# Altium schematic sheet battery.SchDoc
size B
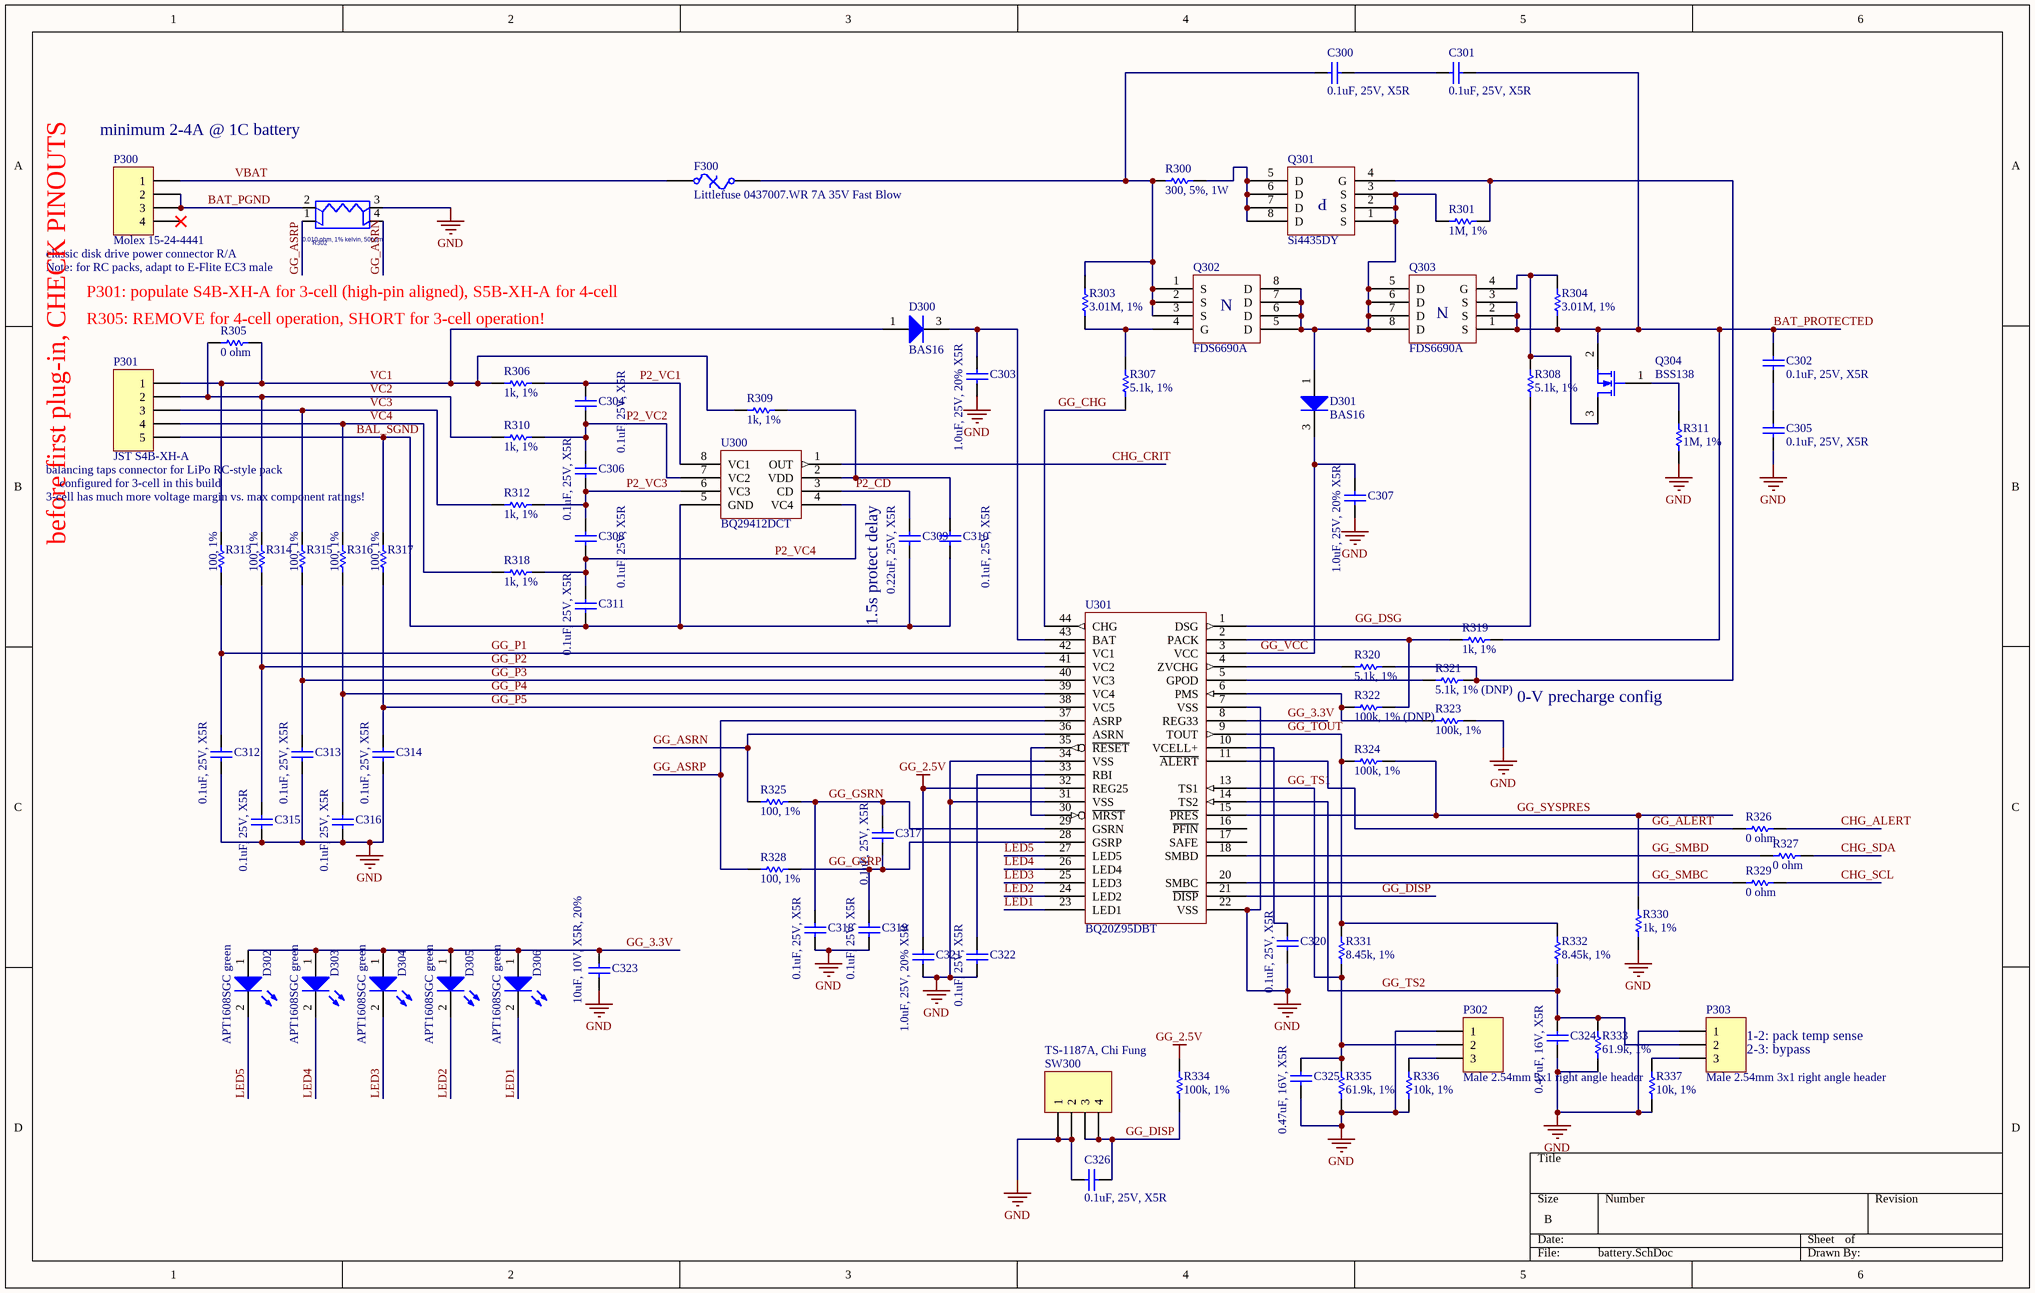
[diagram p0: battery.SchDoc]

## Parts
C300  0.1uF, 25V, X5R  [CAPC1005N]
C301  0.1uF, 25V, X5R  [CAPC1005N]
C302  0.1uF, 25V, X5R  [CAPC1005N]
C303  1.0uF, 25V, 20% X5R  [CAPC1608N]
C304  0.1uF, 25V, X5R  [CAPC1005N]
C305  0.1uF, 25V, X5R  [CAPC1005N]
C306  0.1uF, 25V, X5R  [CAPC1005N]
C307  1.0uF, 25V, 20% X5R  [CAPC1608N]
C308  0.1uF, 25V, X5R  [CAPC1005N]
C309  0.22uF, 25V, X5R  [CAPC1005N]
C310  0.1uF, 25V, X5R  [CAPC1005N]
C311  0.1uF, 25V, X5R  [CAPC1005N]
C312  0.1uF, 25V, X5R  [CAPC1005N]
C313  0.1uF, 25V, X5R  [CAPC1005N]
C314  0.1uF, 25V, X5R  [CAPC1005N]
C315  0.1uF, 25V, X5R  [CAPC1005N]
C316  0.1uF, 25V, X5R  [CAPC1005N]
C317  0.1uF, 25V, X5R  [CAPC1005N]
C318  0.1uF, 25V, X5R  [CAPC1005N]
C319  0.1uF, 25V, X5R  [CAPC1005N]
C320  0.1uF, 25V, X5R  [CAPC1005N]
C321  1.0uF, 25V, 20% X5R  [CAPC1608N]
C322  0.1uF, 25V, X5R  [CAPC1005N]
C323  10uF, 10V, X5R, 20%  [CAPC1608N]
C324  0.47uF, 16V, X5R  [CAPC1005N]
C325  0.47uF, 16V, X5R  [CAPC1005N]
C326  0.1uF, 25V, X5R  [CAPC1005N]
D300  BAS16  [SOT23-3N]
D301  BAS16  [SOT23-3N]
D302  APT1608SGC green  [CD1608-0603]
D303  APT1608SGC green  [CD1608-0603]
D304  APT1608SGC green  [CD1608-0603]
D305  APT1608SGC green  [CD1608-0603]
D306  APT1608SGC green  [CD1608-0603]
F300  Littlefuse 0437007.WR 7A 35V Fast Blow  [RESC3216N]
P300  Molex 15-24-4441  [MOLEX_15-24-4441]
P301  JST S4B-XH-A  [JST_S5B-XH-A_OPT4]
P302  Male 2.54mm 3x1 right angle header  [HDR1X3H]
P303  Male 2.54mm 3x1 right angle header  [HDR1X3H]
Q301  Si4435DY  [SOIC127P600-8AN]
Q302  FDS6690A  [SOIC127P600-8AN]
Q303  FDS6690A  [SOIC127P600-8AN]
Q304  BSS138  [SOT23-3N]
R300  300, 5%, 1W  [RESC6432N]
R301  1M, 1%  [RESC1005N]
R302  0.010 ohm, 1% kelvin, 50ppm  [OHMITE_LVK_1206_KELVIN]
R303  3.01M, 1%  [RESC1005N]
R304  3.01M, 1%  [RESC1005N]
R305  0 ohm  [RESC1005N]
R306  1k, 1%  [RESC1005N]
R307  5.1k, 1%  [RESC1005N]
R308  5.1k, 1%  [RESC1005N]
R309  1k, 1%  [RESC1005N]
R310  1k, 1%  [RESC1005N]
R311  1M, 1%  [RESC1005N]
R312  1k, 1%  [RESC1005N]
R313  100, 1%  [RESC1005N]
R314  100, 1%  [RESC1005N]
R315  100, 1%  [RESC1005N]
R316  100, 1%  [RESC1005N]
R317  100, 1%  [RESC1005N]
R318  1k, 1%  [RESC1005N]
R319  1k, 1%  [RESC1005N]
R320  5.1k, 1%  [RESC1005N]
R321  5.1k, 1% (DNP)  [RESC1005N]
R322  100k, 1% (DNP)  [RESC1005N]
R323  100k, 1%  [RESC1005N]
R324  100k, 1%  [RESC1005N]
R325  100, 1%  [RESC1005N]
R326  0 ohm  [RESC1005N]
R327  0 ohm  [RESC1005N]
R328  100, 1%  [RESC1005N]
R329  0 ohm  [RESC1005N]
R330  1k, 1%  [RESC1005N]
R331  8.45k, 1%  [RESC1005N]
R332  8.45k, 1%  [RESC1005N]
R333  61.9k, 1%  [RESC1005N]
R334  100k, 1%  [RESC1005N]
R335  61.9k, 1%  [RESC1005N]
R336  10k, 1%  [RESC1005N]
R337  10k, 1%  [RESC1005N]
SW300  TS-1187A, Chi Fung  [SWITCH_TS-1187A]
U300  BQ29412DCT  [TSOP65P490-8AN]
U301  BQ20Z95DBT  [TSSOP50P640-44N]

## Nets
GG_2.5V: C321.1 R334.2 U301.32(REG25)
GND: C303.2 C305.1 C307.2 C312.2 C313.2 C314.2 C315.2 C316.2 C318.2 C319.2 C320.2 C321.2 C322.2 C323.2 C324.2 C325.2 C326.2 P302.1 P303.1 R302.3 R311.2 R323.2 R330.2 R333.1 R335.1 R336.1 R337.1 SW300.1 SW300.2 U301.7(VSS) U301.22(VSS) U301.31(VSS) U301.34(VSS)
BAL_SGND: C309.2 C310.2 C311.2 P301.5 R317.1 U300.5(GND)
BAT_PGND: P300.2 P300.3 R302.2
BAT_PROTECTED: C301.1 C302.2 Q303.1(S) Q303.2(S) Q303.3(S) Q304.2(S) R304.2 R319.1
CHG_ALERT: R326.2
CHG_CRIT: U300.1(OUT)
CHG_SCL: R329.2
CHG_SDA: R327.2
GG_3.3V: C323.1 D302.1(A) D303.1(A) D304.1(A) D305.1(A) D306.1(A) U301.8(REG33)
GG_ALERT: R326.1 U301.11(~{ALERT})
GG_ASRN: R302.4 R325.2 U301.36(ASRN)
GG_ASRP: R302.1 R328.2 U301.37(ASRP)
GG_CHG: R307.2 U301.44(CHG)
GG_DISP: C326.1 R334.1 SW300.3 SW300.4 U301.21(~{DISP})
GG_DSG: R308.2 U301.1(DSG)
GG_GSRN: C317.1 C318.1 R325.1 U301.29(GSRN)
GG_GSRP: C317.2 C319.1 R328.1 U301.28(GSRP)
GG_P1: C312.1 R313.2 U301.42(VC1)
GG_P2: C315.1 R314.2 U301.41(VC2)
GG_P3: C313.1 R315.2 U301.40(VC3)
GG_P4: C316.1 R316.2 U301.39(VC4)
GG_P5: C314.1 R317.2 U301.38(VC5)
GG_SMBC: R329.1 U301.20(SMBC)
GG_SMBD: R327.1 U301.18(SMBD)
GG_SYSPRES: R324.2 R330.1 U301.15(~{PRES})
GG_TOUT: R324.1 R331.2 R332.2 U301.9(TOUT)
GG_TS1: C325.1 P302.2 R331.1 R335.2 U301.13(TS1)
GG_TS2: C324.1 P303.2 R332.1 R333.2 U301.14(TS2)
GG_VCC: C307.1 D301.3(K) U301.3(VCC)
LED1: D306.2(K) U301.23(LED1)
LED2: D305.2(K) U301.24(LED2)
LED3: D304.2(K) U301.25(LED3)
LED4: D303.2(K) U301.26(LED4)
LED5: D302.2(K) U301.27(LED5)
P2_CD: C309.1 U300.3(CD)
P2_VC1: C304.1 R306.2 U300.8(VC1)
P2_VC2: C304.2 C306.1 R310.2 U300.7(VC2)
P2_VC3: C306.2 C308.1 R312.2 U300.6(VC3)
P2_VC4: C308.2 C311.1 R318.2 U300.4(VC4)
VBAT: F300.1 P300.1
VC1: D300.1(A) P301.1 R305.2 R306.1 R309.1 R313.1
VC2: P301.2 R305.1 R310.1 R314.1
VC3: P301.3 R312.1 R315.1
VC4: P301.4 R316.1 R318.1
NetC300_1: C300.1 C301.2
NetC300_2: C300.2 F300.2 Q302.1(S) Q302.2(S) Q302.3(S) R300.2 R303.1
NetC302_1: C302.1 C305.2
NetC303_1: C303.1 D300.3(K) U301.43(BAT)
NetC310_1: C310.1 R309.2 U300.2(VDD)
NetC320_1: C320.1 U301.10(VCELL+)
NetC322_1: C322.1 U301.33(RBI)
NetD301_1: D301.1(A) Q301.1(S) Q301.2(S) Q301.3(S) Q302.5(D) Q302.6(D) Q302.7(D) Q302.8(D) Q303.5(D) Q303.6(D) Q303.7(D) Q303.8(D) R301.2
NetP302_3: P302.3 R336.2
NetP303_3: P303.3 R337.2
NetQ301_4: Q301.4(G) R301.1 R320.1 R321.1
NetQ301_5: Q301.5(D) Q301.6(D) Q301.7(D) Q301.8(D) R300.1
NetQ302_4: Q302.4(G) R303.2 R307.1
NetQ303_4: Q303.4(G) Q304.3(D) R304.1 R308.1
NetQ304_1: Q304.1(G) R311.1
NetR319_2: R319.2 R322.2 U301.2(PACK)
NetR320_2: R320.2 U301.4(ZVCHG)
NetR321_2: R321.2 U301.5(GPOD)
NetR322_1: R322.1 R323.1 U301.6(PMS)
NetU301_30: U301.30(~{MRST}) U301.35(~{RESET})

Not connected (* = marked no-connect by the designer): P300 4*; U301 16(~{PFIN}) 17(SAFE)

## Notes on the sheet
- (near P300) minimum 2-4A @ 1C battery
- (near P300) classic disk drive power connector R/A
- Note: for RC packs, adapt to E-Flite EC3 male
- P301: populate S4B-XH-A for 3-cell (high-pin aligned), S5B-XH-A for 4-cell
- (near R305) R305: REMOVE for 4-cell operation, SHORT for 3-cell operation!
- (near P301) balancing taps connector for LiPo RC-style pack
- 3-cell has much more voltage margin vs. max component ratings!
- configured for 3-cell in this build
- before first plug-in, CHECK PINOUTS
- (near C309) 1.5s protect delay
- 0-V precharge config
- (near P303) 1-2: pack temp sense
- (near P303) 2-3: bypass
- (in symbol FDS6690A) N
- (in symbol Si4435DY) P

## Library data of the parts
C300-C326 = Cap Semi: Capacitor (Semiconductor SIM Model); Published: 8-Jun-2000; LatestRevisionDate: 17-Jul-2002; LatestRevisionNote: Re-released for DXP Platform.; PackageReference: C1206; Publisher: Altium Limited
D300 D301 = Diode 1N4148: Silicon diode; Published: 8-Jun-2000; LatestRevisionDate: 17-Jul-2002; LatestRevisionNote: Re-released for DXP Platform.; DatasheetVersion: 1997; PackageReference: DO-35; Publisher: Altium Limited; PackageDescription: Diode, Axial; Body 3.8 x 1.9 mm (LxDia. max), Lead Dia. 0.53 mm (max); Code_JEDEC: DO-204-AH; ComponentLink1Description: Manufacturer Link; ComponentLink1URL: http://www.fairchildsemi.com/; ComponentLink2Description: Datasheet; ComponentLink2URL: http://www.fairchildsemi.com/ds/1N%2F1N4148.pdf
D302-D306 = LED2: Typical RED, GREEN, YELLOW, AMBER GaAs LED; Published: 8-Jun-2000; LatestRevisionDate: 17-Jul-2002; LatestRevisionNote: Re-released for DXP Platform.; PackageVersion: Feb-2002; PackageReference: 3.2X1.6X1.1; Publisher: Altium Limited
F300 = Fuse Thermal: Thermal Fuse; Published: 24-Mar-1999; Revision: July-2002: Re-released for DXP Platform.; Publisher: Altium Limited
P300 = Header 4: Classic PC hard drive power connector, RA; LatestRevisionDate: 17-Jul-2002; LatestRevisionNote: Re-released for DXP Platform.; Publisher: Altium Limited
P301 = Header 5: JST S4B-XH-A 2.5mm RA connector, stuffed in 5-pin slot, high pin aligned; LatestRevisionDate: 17-Jul-2002; LatestRevisionNote: Re-released for DXP Platform.; Publisher: Altium Limited
P302 P303 = Header 3H: Header, 3-Pin, Right Angle; LatestRevisionDate: 17-Jul-2002; LatestRevisionNote: Re-released for DXP Platform.; Publisher: Altium Limited
Q301 = Si4435DY: Singre P-channel FET, 8A, 30V
Q302 Q303 = FDS6690A: Single N-channel FET, 11A, 30V
Q304 = MOSFET-N: N-Channel MOSFET; Published: 8-Jun-2000; LatestRevisionDate: 17-Jul-2002; LatestRevisionNote: Re-released for DXP Platform.; PackageVersion: 1995/1996; PackageReference: E3; Publisher: Altium Limited
R300 R301 R303-R321 R325-R333 R335-R337 = Res1: Resistor; Value: 100k; Published: 8-Jun-2000; LatestRevisionDate: 17-Jul-2002; LatestRevisionNote: Re-released for DXP Platform.; PackageReference: AXIAL-0.3; Publisher: Altium Limited
R302 = RES_4TERM: PART_NUMBER: R00034-001; CDS_LMAN_SYM_OUTLINE: -100,25,100,-75; NEEDS_NO_SIZE: TRUE; PATH: I224; PN: #; OriginalSymbolOrigin: (-100,50); LOCATION: RN32; SEC: 1; XY: (-5650,2000); WATTAGE: 1/2W; PHYS_PAGE: 12; PACK_TYPE: RES1206_4T; MFG_PN: LVK12R020FER; MFG: OHMITE; DRAWING: @BROWNSTONE_LIB.BROWNSTONE(SCH_1):PAGE12; CDS_LIB: resistors; MATERIAL: CH; TOLERANCE: ?; VER: 1; TOL: 1%; ROT: 1; CDS_SEC: 1; CDS_LOCATION: RN32; $TOLERANCE: ?; $SEC: 1; $PN: #; $LOCATION: RN32
R322-R324 R334 = Res1: Resistor; Published: 8-Jun-2000; LatestRevisionDate: 17-Jul-2002; LatestRevisionNote: Re-released for DXP Platform.; PackageReference: AXIAL-0.3; Publisher: Altium Limited; Value: 100k
SW300 = Header 4: Chi Fung TS-1187A; LatestRevisionDate: 17-Jul-2002; LatestRevisionNote: Re-released for DXP Platform.; Publisher: Altium Limited
U300 = BQ2941XDCT: Voltage protection for 2-,3-, and 4-cell LiIon batteries (2nd level)
U301 = BQ20Z95DBT: SBS 1.1-Compliant Gas Gauge and Protection with Impedance Track (TM)